# EAGLE design 2020-03-07 LN2 Autofill Connectors - Copy (EAGLE 9.6.2)
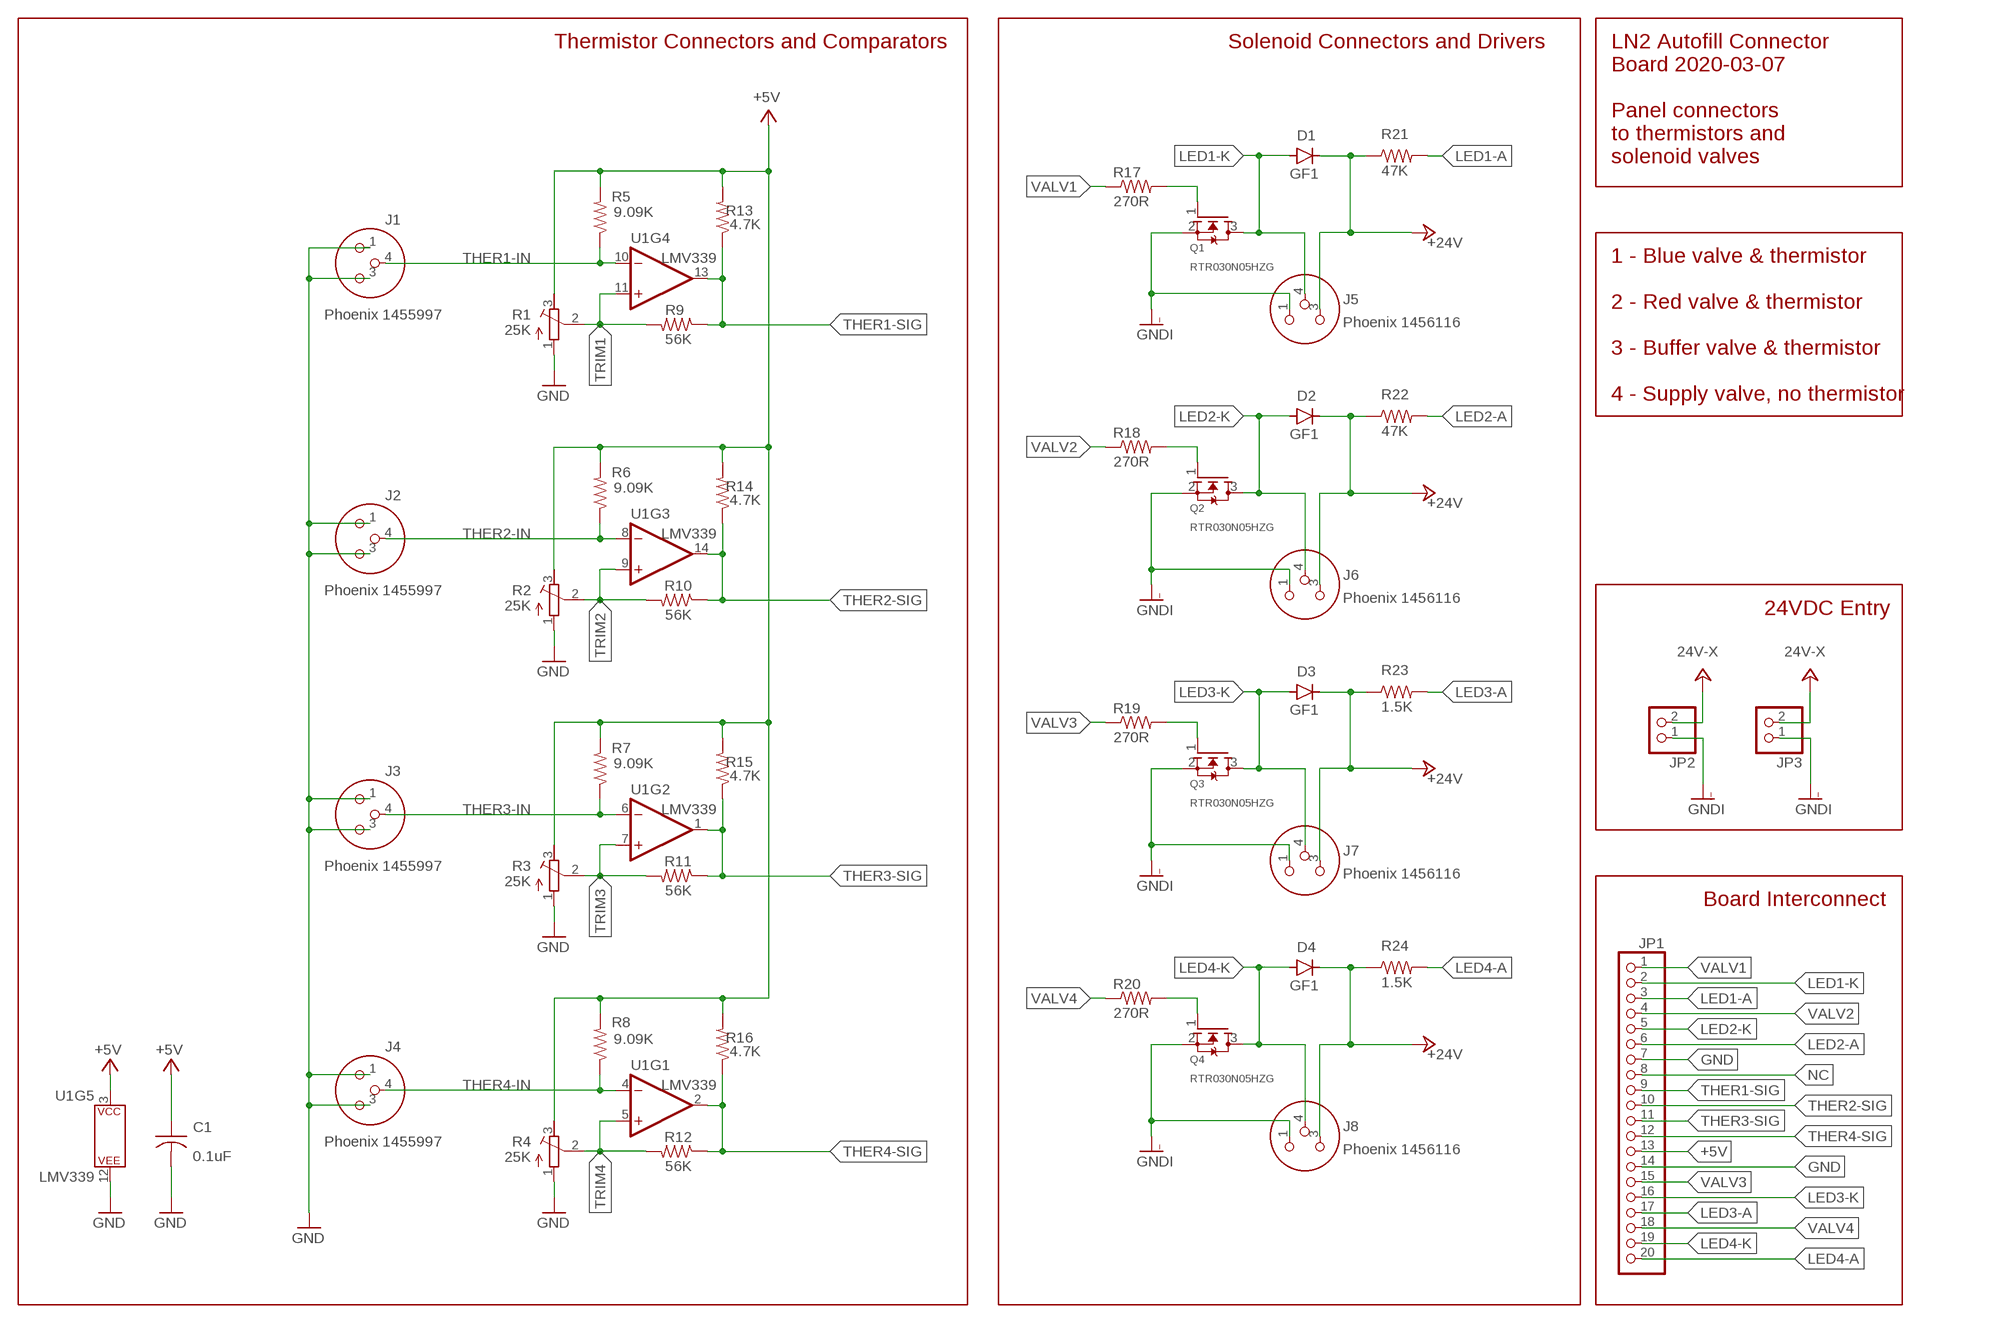
[diagram p0: schematic, sheet 1]

## Parts
C1  0.1uF  C-USC0805  [C0805]
D1  GF1  [SMA-DO214AC]
D2  GF1  [SMA-DO214AC]
D3  GF1  [SMA-DO214AC]
D4  GF1  [SMA-DO214AC]
J1  Phoenix 1455997  PHOENIX-3PIN-MALE  [PHOENIX-3PIN]
J2  Phoenix 1455997  PHOENIX-3PIN-MALE  [PHOENIX-3PIN]
J3  Phoenix 1455997  PHOENIX-3PIN-MALE  [PHOENIX-3PIN]
J4  Phoenix 1455997  PHOENIX-3PIN-MALE  [PHOENIX-3PIN]
J5  Phoenix 1456116  PHOENIX-3PIN-FEMALE  [PHOENIX-3PIN-FEMALE]
J6  Phoenix 1456116  PHOENIX-3PIN-FEMALE  [PHOENIX-3PIN-FEMALE]
J7  Phoenix 1456116  PHOENIX-3PIN-FEMALE  [PHOENIX-3PIN-FEMALE]
J8  Phoenix 1456116  PHOENIX-3PIN-FEMALE  [PHOENIX-3PIN-FEMALE]
JP1  PINHD-1X20  [1X20]
JP2  PINHD-1X2MOLEX-02-VERT  [MOLEX-02-VERT]
JP3  PINHD-1X2MOLEX-02-VERT  [MOLEX-02-VERT]
Q1  RTR030N05HZG  MOSFET-NREFLOW  [SOT23]
Q2  RTR030N05HZG  MOSFET-NREFLOW  [SOT23]
Q3  RTR030N05HZG  MOSFET-NREFLOW  [SOT23]
Q4  RTR030N05HZG  MOSFET-NREFLOW  [SOT23]
R1  25K  R-TRIMM3296Y  [RTRIM3296Y]
R2  25K  R-TRIMM3296Y  [RTRIM3296Y]
R3  25K  R-TRIMM3296Y  [RTRIM3296Y]
R4  25K  R-TRIMM3296Y  [RTRIM3296Y]
R5  9.09K  R-US_R0805  [R0805]
R6  9.09K  R-US_R0805  [R0805]
R7  9.09K  R-US_R0805  [R0805]
R8  9.09K  R-US_R0805  [R0805]
R9  56K  R-US_R0805  [R0805]
R10  56K  R-US_R0805  [R0805]
R11  56K  R-US_R0805  [R0805]
R12  56K  R-US_R0805  [R0805]
R13  4.7K  R-US_R0805  [R0805]
R14  4.7K  R-US_R0805  [R0805]
R15  4.7K  R-US_R0805  [R0805]
R16  4.7K  R-US_R0805  [R0805]
R17  270R  R-US_R0805  [R0805]
R18  270R  R-US_R0805  [R0805]
R19  270R  R-US_R0805  [R0805]
R20  270R  R-US_R0805  [R0805]
R21  47K  R-US_R0805  [R0805]
R22  47K  R-US_R0805  [R0805]
R23  1.5K  R-US_R0805  [R0805]
R24  1.5K  R-US_R0805  [R0805]
U1  LMV339  LM339SOIC-14  [SOIC127P599X175-14]

## Nets
+5V: C1.1 JP1.13 R1.3(E) R2.3(E) R3.3(E) R4.3(E) R5.2 R6.2 R7.2 R8.2 R13.2 R14.2 R15.2 R16.2 U1.3(P$V+)
+24V: D1.K(C) D2.K(C) D3.K(C) D4.K(C) J5.3 J6.3 J7.3 J8.3 JP2.2 JP3.2 R21.1 R22.1 R23.1 R24.1 ; supply symbol labelled 24V-X
GND: C1.2 J1.1 J1.3 J2.1 J2.3 J3.1 J3.3 J4.1 J4.3 JP1.7 JP1.14 R1.1(A) R2.1(A) R3.1(A) R4.1(A) U1.12(P$V-)
GNDI: J5.1 J6.1 J7.1 J8.1 JP2.1 JP3.1 Q1.2(S) Q2.2(S) Q3.2(S) Q4.2(S)
LED1-A: JP1.3 R21.2
LED1-K: D1.A J5.4 JP1.2 Q1.3(D)
LED2-A: JP1.6 R22.2
LED2-K: D2.A J6.4 JP1.5 Q2.3(D)
LED3-A: JP1.17 R23.2
LED3-K: D3.A J7.4 JP1.16 Q3.3(D)
LED4-A: JP1.20 R24.2
LED4-K: D4.A J8.4 JP1.19 Q4.3(D)
N$1: Q1.1(G) R17.2
N$2: Q2.1(G) R18.2
N$3: Q3.1(G) R19.2
N$4: Q4.1(G) R20.2
NC: JP1.8
THER1-IN: J1.4 R5.1 U1.10(-IN)
THER1-SIG: JP1.9 R9.1 R13.1 U1.13(OUT)
THER2-IN: J2.4 R6.1 U1.8(-IN)
THER2-SIG: JP1.10 R10.1 R14.1 U1.14(OUT)
THER3-IN: J3.4 R7.1 U1.6(-IN)
THER3-SIG: JP1.11 R11.1 R15.1 U1.1(OUT)
THER4-IN: J4.4 R8.1 U1.4(-IN)
THER4-SIG: JP1.12 R12.1 R16.1 U1.2(OUT)
TRIM1: R1.2(S) R9.2 U1.11(+IN)
TRIM2: R2.2(S) R10.2 U1.9(+IN)
TRIM3: R3.2(S) R11.2 U1.7(+IN)
TRIM4: R4.2(S) R12.2 U1.5(+IN)
VALV1: JP1.1 R17.1
VALV2: JP1.4 R18.1
VALV3: JP1.15 R19.1
VALV4: JP1.18 R20.1

## Notes on the sheet
- Thermistor Connectors and Comparators | Solenoid Connectors and Drivers
- LN2 Autofill Connector
  Board 2020-03-07
  
  Panel connectors
  to thermistors and
  solenoid valves
- 1 - Blue valve & thermistor
  
  2 - Red valve & thermistor
  
  3 - Buffer valve & thermistor
  
  4 - Supply valve, no thermistor
- 24VDC Entry
- Board Interconnect

## Library data of the parts
C1 = AUmlib:C-US: CAPACITOR, American symbol; SPICEPREFIX: C
D1-D4 = AUmlib:GF1: DIODE
J1-J4 = AUmlib:PHOENIX-3PIN-MALE
J5-J8 = AUmlib:PHOENIX-3PIN-FEMALE: Phoenix Contact 3-pin circular M8 female PCB 1456116
JP1 = AUmlib:PINHD-1X20: PIN HEADER
JP2 JP3 = AUmlib:PINHD-1X2: PIN HEADER
Q1-Q4 = AUmlib:MOSFET-N: N-Channel Mosfet 2N7002E - 60V 260mA SOT23 [Digikey: 2N7002ET1GOSTR-ND] - REEL BSH103 - 30V 850mA SOT23 [Digikey: 568-5013-1-ND]
R1-R4 = AUmlib:R-TRIMM: Trimm resistor; SPICEMODEL: X; SPICEPREFIXL: POT
R5-R24 = AUmlib:R-US_: RESISTOR, American symbol; SPICEPREFIX: R
U1 = AUmlib:LM339: Quad Comparator - LM339PWR Based on information from the SLCS006N datasheet from TI (www.ti.com). Created by nick@scantool.net, 2008. Updated 2016. SparkFun Products SparkFun OBD-II UART <https://www.sparkfun.com/products/9555> (WIG-09555) SparkFun Car Diagnostics Kit <https://www.sparkfun.com/products/10769> (RTL-10769)

## Board
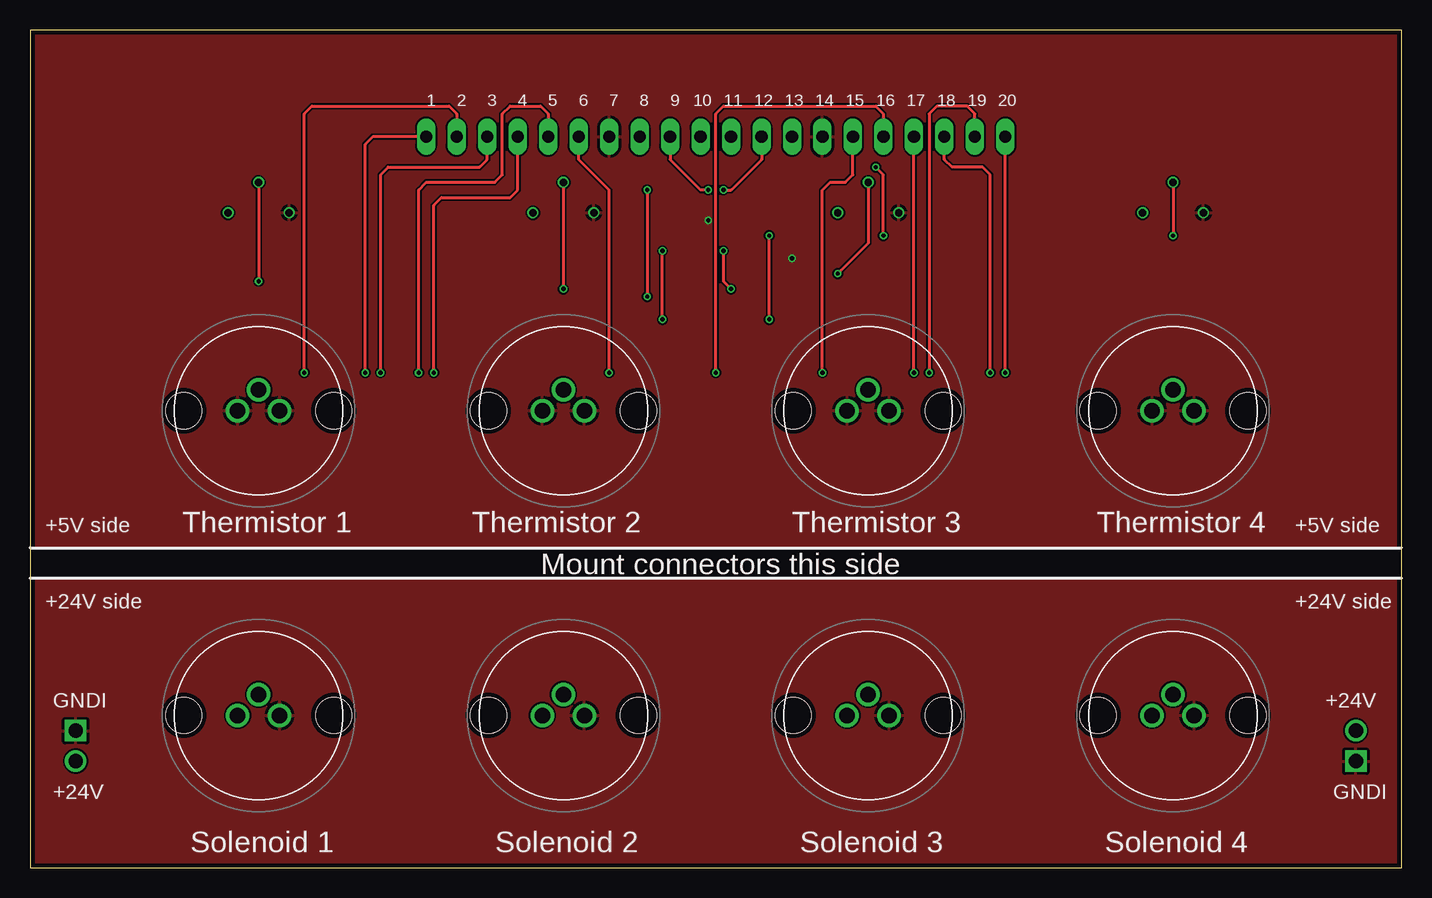
[diagram p1: board, top side]
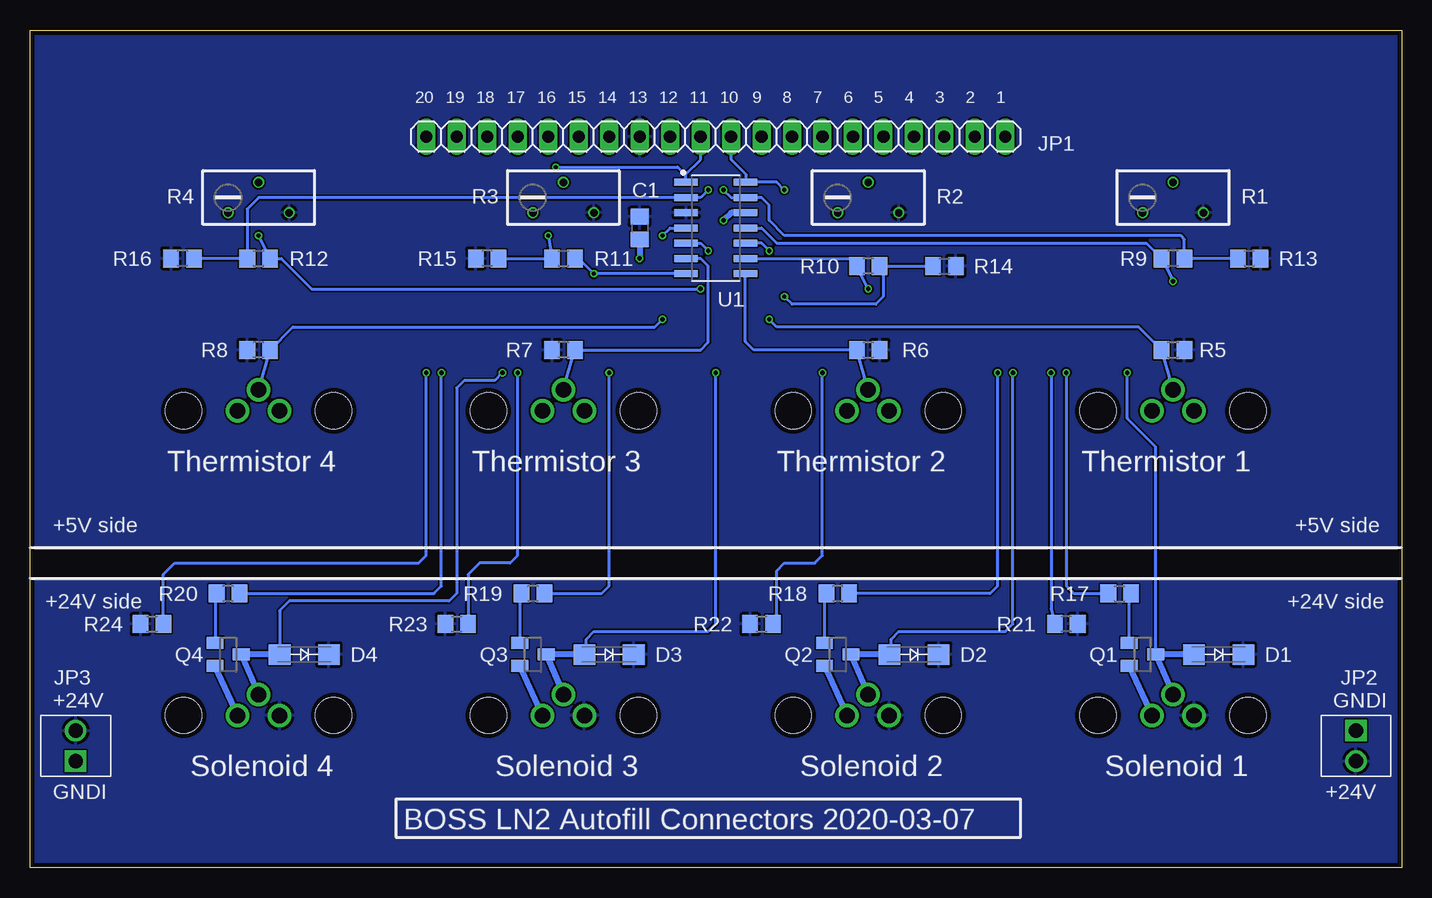
[diagram p2: board, bottom side, seen from below]

Size 114.3 x 69.85 mm. Coordinates in mm from the lower left corner, seen from the top.
Outline: 0,0 114.3,0 114.3,69.85 0,69.85 0,0
Copper layers (1*16): Top 0.035559375mm / dielectric 1.6mm / Bottom 0.035559375mm
Design rules "oshpark-2layer": minimum track width 6mil, minimum drill 10mil, track to track 6mil, track to pad 6mil, pad to pad 6mil, via to via 6mil, smd to smd 6mil, copper to edge 15mil, drill to drill 6mil, minimum pad ring 5mil, minimum via ring 5mil, stop-mask expansion 2.5mil, vias tented up to drill 0mil, thermal gap 10mil

### Footprints (pad centres in the part's own frame; a part is rotated, then mirrored left to right if it is on the bottom)
C0805 = smd 1.3 x 1.5: 1 -0.95,0; 2 0.95,0
SMA-DO214AC = smd 1.8 x 1.7: A -2.05,0; K 2.05,0
PHOENIX-3PIN = drill 1.3: 1 1.75,0; 3 -1.75,0; 4 0,1.75 | hole 3: -6.25,0; 6.25,0
PHOENIX-3PIN-FEMALE = drill 1.3: 1 1.75,0; 3 -1.75,0; 4 0,1.75 | hole 3: -6.25,0; 6.25,0
1X20 = drill 1.016 long: 1 -24.13,0; 2 -21.59,0; 3 -19.05,0; 4 -16.51,0; 5 -13.97,0; 6 -11.43,0; 7 -8.89,0; 8 -6.35,0; 9 -3.81,0; 10 -1.27,0; 11 1.27,0; 12 3.81,0; 13 6.35,0; 14 8.89,0; 15 11.43,0; 16 13.97,0; 17 16.51,0; 18 19.05,0; 19 21.59,0; 20 24.13,0
MOLEX-02-VERT = drill 1.194 square: 1 0,0 | drill 1.194: 2 2.54,0
SOT23 = smd 1 x 1.4: 1 -0.95,-1.1; 2 0.95,-1.1; 3 0,1.1
RTRIM3296Y = drill 0.61: 1 1.27,-2.54; 2 -1.27,0; 3 1.27,2.54
R0805 = smd 1.3 x 1.5: 1 -0.95,0; 2 0.95,0
SOIC127P599X175-14 = smd 1.967 x 0.594: 1 -2.469,3.81; 2 -2.469,2.54; 3 -2.469,1.27; 4 -2.469,0; 5 -2.469,-1.27; 6 -2.469,-2.54; 7 -2.469,-3.81; 8 2.469,-3.81; 9 2.469,-2.54; 10 2.469,-1.27; 11 2.469,0; 12 2.469,1.27; 13 2.469,2.54; 14 2.469,3.81

### Placement (x,y rotation side)
C1  63.5,53.34 270 bottom
D1  15.24,17.78 0 bottom
D2  40.64,17.78 0 bottom
D3  66.04,17.78 0 bottom
D4  91.44,17.78 0 bottom
J1  19.05,38.1 0 top
J2  44.45,38.1 0 top
J3  69.85,38.1 0 top
J4  95.25,38.1 0 top
J5  19.05,12.7 0 top
J6  44.45,12.7 0 top
J7  69.85,12.7 0 top
J8  95.25,12.7 0 top
JP1  57.15,60.96 180 bottom
JP2  3.81,11.43 270 bottom
JP3  110.49,8.89 90 bottom
Q1  21.59,17.78 270 bottom
Q2  46.99,17.78 270 bottom
Q3  72.39,17.78 270 bottom
Q4  97.79,17.78 270 bottom
R1  19.05,55.88 270 bottom
R2  44.45,55.88 270 bottom
R3  69.85,55.88 270 bottom
R4  95.25,55.88 270 bottom
R5  19.05,43.18 0 bottom
R6  44.45,43.18 0 bottom
R7  69.85,43.18 180 bottom
R8  95.25,43.18 180 bottom
R9  19.05,50.8 180 bottom
R10  44.45,50.16 180 bottom
R11  69.85,50.8 0 bottom
R12  95.25,50.8 0 bottom
R13  12.7,50.8 0 bottom
R14  38.1,50.16 0 bottom
R15  76.2,50.8 180 bottom
R16  101.6,50.8 180 bottom
R17  23.5,22.86 0 bottom
R18  46.99,22.86 180 bottom
R19  72.39,22.86 180 bottom
R20  97.79,22.86 180 bottom
R21  27.94,20.32 180 bottom
R22  53.34,20.32 0 bottom
R23  78.74,20.32 0 bottom
R24  104.14,20.32 0 bottom
U1  57.15,53.34 0 bottom

### Tracks (layer width: path | path; a pad name or v marks a point on that pad's centre or on a via)
+5V
  pour Bottom: 114.3,26.67 0,26.67 0,69.85 102.23,69.85 102.27,69.82 114.3,69.82
+24V
  pour Bottom: 114.3,0 0,0 0,24.13 114.3,24.13
GND  (via drill 0.35)
  Bottom 0.508: C1.2 v63.5,50.8 | U1.12 55.88,54.61 v56.52,53.98
  pour Top: 114.3,26.67 0,26.67 0,69.85 114.3,69.85
GNDI
  Bottom 0.508: Q2.2 J6.1 | Q1.2 J5.1 | Q3.2 J7.1 | Q4.2 J8.1
  pour Top: 114.3,0 0,0 0,24.13 114.3,24.13
LED1-A  (via drill 0.35)
  Top 0.254: v29.21,41.27 29.21,57.78 29.84,58.42 37.47,58.42 38.1,59.05 JP1.3
  Bottom 0.254: v29.21,41.27 29.21,21.59 R21.2
LED1-K  (via drill 0.35)
  Top 0.254: v22.86,41.27 22.86,62.87 23.5,63.5 34.92,63.5 35.56,62.87 JP1.2
  Bottom 0.254: Q1.3 20.49,35.09 22.86,37.47 v22.86,41.27
  Bottom 0.508: D1.A Q1.3 J5.4
LED2-A  (via drill 0.35)
  Top 0.254: v48.26,41.27 48.26,56.52 45.72,59.05 JP1.6
  Bottom 0.254: R22.2 52.07,20.64 52.07,24.77 51.44,25.4 48.9,25.4 48.26,26.04 v48.26,41.27
LED2-K  (via drill 0.35)
  Top 0.254: v32.38,41.27 32.38,56.52 33.02,57.15 38.73,57.15 39.37,57.78 39.37,62.87 40.01,63.5 42.55,63.5 43.18,62.87 JP1.5
  Bottom 0.254: D2.A 42.55,17.93 42.55,19.05 41.91,19.68 33.02,19.68 32.38,20.32 v32.38,41.27
  Bottom 0.508: J6.4 Q2.3 D2.A
LED3-A  (via drill 0.35)
  Top 0.254: v73.66,41.27 JP1.17
  Bottom 0.254: v73.66,41.27 73.66,26.04 74.3,25.4 76.83,25.4 77.79,24.45 R23.2
LED3-K  (via drill 0.35)
  Top 0.254: v57.15,41.27 57.15,62.87 57.78,63.5 70.48,63.5 71.12,62.87 JP1.16
  Bottom 0.254: D3.A 67.94,17.93 67.94,19.05 67.31,19.68 57.78,19.68 57.15,20.32 v57.15,41.27
  Bottom 0.508: D3.A Q3.3 J7.4
LED4-A  (via drill 0.35)
  Top 0.254: v81.28,41.27 JP1.20
  Bottom 0.254: R24.2 103.19,24.45 102.23,25.4 81.92,25.4 81.28,26.04 v81.28,41.27
LED4-K  (via drill 0.35)
  Top 0.254: JP1.19 78.74,62.87 78.11,63.5 75.56,63.5 74.93,62.87 v74.93,41.27
  Bottom 0.254: v74.93,41.27 75.56,40.64 78.11,40.64 78.74,40 78.74,22.86 79.38,22.23 92.71,22.23 93.49,21.45 D4.A
  Bottom 0.508: D4.A Q4.3 J8.4
N$1
  Bottom 0.254: Q1.1 22.69,22.71 R17.2
N$2
  Bottom 0.254: Q2.1 48.09,22.71 R18.2
N$3
  Bottom 0.254: R19.2 73.49,22.71 Q3.1
N$4
  Bottom 0.254: R20.2 98.83,22.86 98.83,18.79 Q4.1
THER1-IN  (via drill 0.35)
  Top 0.254: v52.7,45.72 v52.7,51.44
  Bottom 0.254: v52.7,45.72 52.07,45.09 21.91,45.09 R5.1 J1.4 | v52.7,51.44 53.34,52.07 U1.10
THER1-SIG  (via drill 0.35)
  Top 0.254: JP1.9 53.34,59.05 55.88,56.52 v56.52,56.52
  Bottom 0.254: v56.52,56.52 55.88,55.88 U1.13 53.34,55.88 52.7,55.24 52.7,53.98 51.44,52.7 18.41,52.7 18.1,52.39 R9.1 R13.1
THER2-IN
  Bottom 0.254: U1.8 54.68,43.89 53.98,43.18 R6.1 J2.4
THER2-SIG  (via drill 0.35)
  Top 0.254: v51.44,56.52 v51.44,47.62
  Bottom 0.254: JP1.10 55.88,59.05 54.61,57.78 54.61,57.22 U1.14 52.07,57.15 v51.44,56.52 | R14.1 R10.1 43.18,49.84 43.18,47.62 43.81,46.99 50.8,46.99 v51.44,47.62
THER3-IN
  Bottom 0.254: U1.6 58.42,50.8 57.78,50.16 57.78,43.81 58.42,43.18 R7.1 J3.4
THER3-SIG  (via drill 0.35)
  Top 0.254: v71.12,52.7 71.12,57.78 v70.48,58.42
  Bottom 0.254: U1.1 59.69,57.22 59.69,57.78 | 59.69,57.78 58.42,59.05 JP1.11 | v70.48,58.42 60.33,58.42 59.69,57.78 | R15.1 R11.1 v71.12,52.7
THER4-IN  (via drill 0.35)
  Top 0.254: v61.59,45.72 v61.59,52.7
  Bottom 0.254: v61.59,45.72 62.23,45.09 92.39,45.09 R8.1 J4.4 | v61.59,52.7 60.96,53.34 U1.4
THER4-SIG  (via drill 0.35)
  Top 0.254: JP1.12 60.96,59.05 58.42,56.52 v57.78,56.52
  Bottom 0.254: v57.78,56.52 58.42,55.88 U1.2 95.25,55.88 96.2,54.93 R12.1 R16.1
TRIM1  (via drill 0.35)
  Top 0.254: R1.2 v19.05,48.9
  Bottom 0.254: U1.11 53.34,53.34 52.07,52.07 21.27,52.07 R9.2 v19.05,48.9
TRIM2  (via drill 0.35)
  Top 0.254: R2.2 v44.45,48.26
  Bottom 0.254: U1.9 46.03,50.8 R10.2 v44.45,48.26
TRIM3  (via drill 0.35)
  Top 0.254: R3.2 69.85,52.07 v67.31,49.53
  Bottom 0.254: U1.7 v67.31,49.53 68.58,50.8 R11.2
TRIM4  (via drill 0.35)
  Top 0.254: R4.2 v95.25,52.7 | v57.78,51.44 57.78,48.9 v58.42,48.26
  Bottom 0.254: U1.5 58.42,52.07 v57.78,51.44 | v58.42,48.26 90.81,48.26 93.34,50.8 R12.2 v95.25,52.7
VALV1  (via drill 0.35)
  Top 0.254: v27.94,41.27 27.94,60.33 28.57,60.96 JP1.1
  Bottom 0.254: R17.1 27.3,22.86 27.94,23.5 v27.94,41.27
VALV2  (via drill 0.35)
  Top 0.254: v33.66,41.27 33.66,55.24 34.29,55.88 40.01,55.88 40.64,56.52 JP1.4
  Bottom 0.254: v33.66,41.27 33.66,23.5 34.29,22.86 R18.1
VALV3  (via drill 0.35)
  Top 0.254: v66.04,41.27 66.04,56.52 66.67,57.15 67.94,57.15 68.58,57.78 JP1.15
  Bottom 0.254: R19.1 66.67,22.86 66.04,23.5 v66.04,41.27
VALV4  (via drill 0.35)
  Top 0.254: v80.01,41.27 80.01,57.78 79.38,58.42 76.83,58.42 76.2,59.05 JP1.18
  Bottom 0.254: v80.01,41.27 80.01,23.5 80.64,22.86 R20.1

### Text on the board
tPlace: 1 | 2 | 3 | 4 | 5 | 6 | 7 | 8 | 9 | 10 | 11 | 12 | 13 | 14 | 15 | 16 | 17 | 18 | 19 | 20 | +5V side | Thermistor 1 | Thermistor 2 | Thermistor 3 | Thermistor 4 | +5V side | Mount connectors this side | +24V side | +24V side | GNDI | +24V | +24V | GNDI | Solenoid 1 | Solenoid 2 | Solenoid 3 | Solenoid 4
bPlace: 1 | 2 | 3 | 4 | 5 | 6 | 7 | 8 | 9 | 10 | 11 | 12 | 13 | 14 | 15 | 16 | 17 | 18 | 19 | 20 | Thermistor 1 | Thermistor 2 | Thermistor 3 | Thermistor 4 | +5V side | +5V side | +24V side | +24V side | GNDI | +24V | Solenoid 1 | Solenoid 2 | Solenoid 3 | Solenoid 4 | +24V | GNDI | BOSS LN2 Autofill Connectors 2020-03-07